# EAGLE design eksos-rj45-breakout-for_slot (EAGLE 7.7.0)
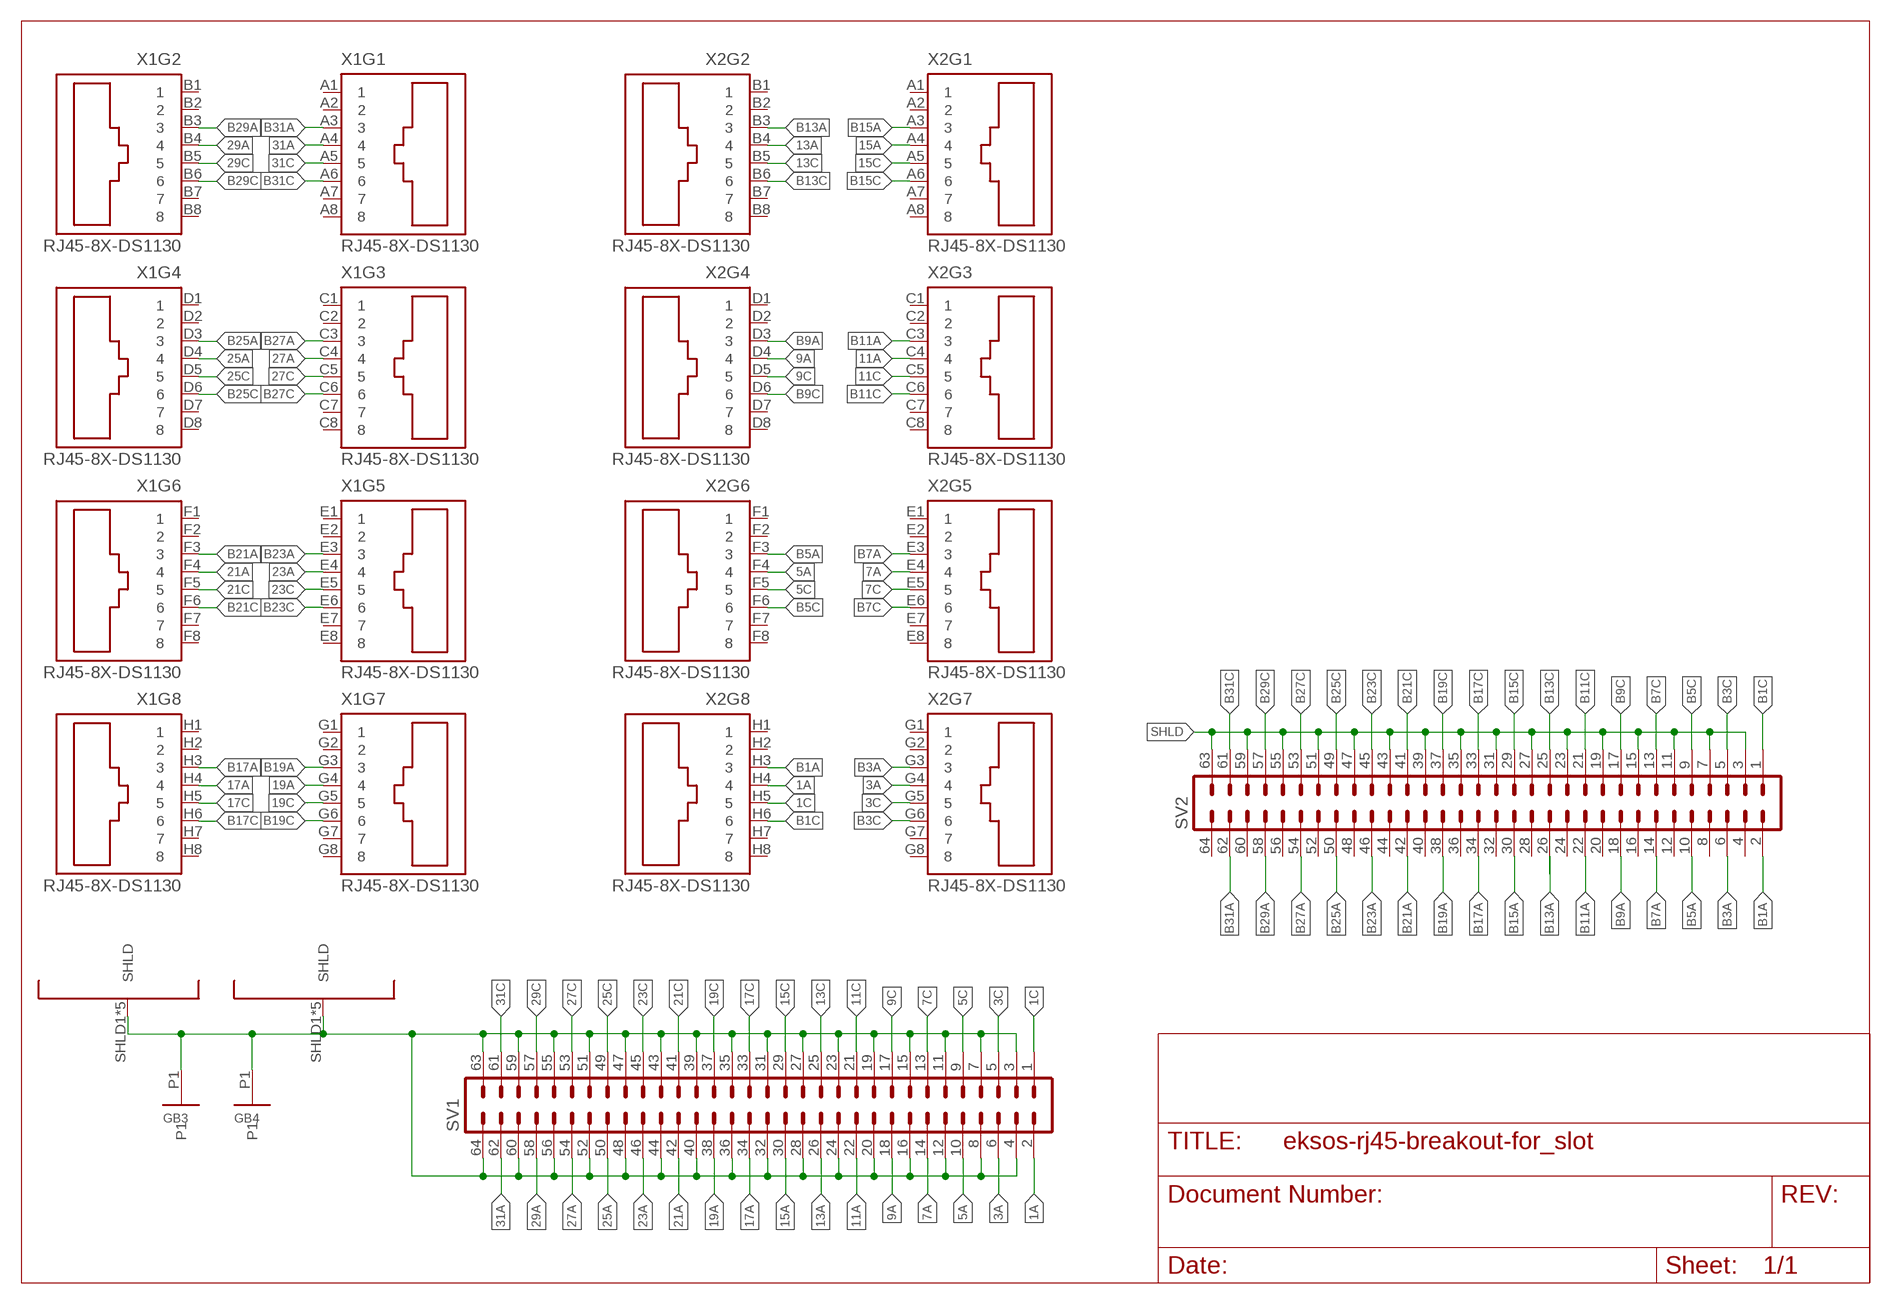
[diagram p0: schematic, sheet 1]

## Parts
GB3  GEWINDEBLOCK-6X6X12M3  [GB6X6X12_VIA]
GB4  GEWINDEBLOCK-6X6X12M3  [GB6X6X12_VIA]
SV1  ML64  [ML64]
SV2  ML64  [ML64]
X1  RJ45-8X-DS1130  [DS1130]
X2  RJ45-8X-DS1130  [DS1130]

## Nets
1A: SV1.2 X2.H4
1C: SV1.1 X2.H5
3A: SV1.6 X2.G4
3C: SV1.5 X2.G5
5A: SV1.10 X2.F4
5C: SV1.9 X2.F5
7A: SV1.14 X2.E4
7C: SV1.13 X2.E5
9A: SV1.18 X2.D4
9C: SV1.17 X2.D5
11A: SV1.22 X2.C4
11C: SV1.21 X2.C5
13A: SV1.26 X2.B4
13C: SV1.25 X2.B5
15A: SV1.30 X2.A4
15C: SV1.29 X2.A5
17A: SV1.34 X1.H4
17C: SV1.33 X1.H5
19A: SV1.38 X1.G4
19C: SV1.37 X1.G5
21A: SV1.42 X1.F4
21C: SV1.41 X1.F5
23A: SV1.46 X1.E4
23C: SV1.45 X1.E5
25A: SV1.50 X1.D4
25C: SV1.49 X1.D5
27A: SV1.54 X1.C4
27C: SV1.53 X1.C5
29A: SV1.58 X1.B4
29C: SV1.57 X1.B5
31A: SV1.62 X1.A4
31C: SV1.61 X1.A5
B1A: SV2.2 X2.H3
B1C: SV2.1 X2.H6
B3A: SV2.6 X2.G3
B3C: SV2.5 X2.G6
B5A: SV2.10 X2.F3
B5C: SV2.9 X2.F6
B7A: SV2.14 X2.E3
B7C: SV2.13 X2.E6
B9A: SV2.18 X2.D3
B9C: SV2.17 X2.D6
B11A: SV2.22 X2.C3
B11C: SV2.21 X2.C6
B13A: SV2.26 X2.B3
B13C: SV2.25 X2.B6
B15A: SV2.30 X2.A3
B15C: SV2.29 X2.A6
B17A: SV2.34 X1.H3
B17C: SV2.33 X1.H6
B19A: SV2.38 X1.G3
B19C: SV2.37 X1.G6
B21A: SV2.42 X1.F3
B21C: SV2.41 X1.F6
B23A: SV2.46 X1.E3
B23C: SV2.45 X1.E6
B25A: SV2.50 X1.D3
B25C: SV2.49 X1.D6
B27A: SV2.54 X1.C3
B27C: SV2.53 X1.C6
B29A: SV2.58 X1.B3
B29C: SV2.57 X1.B6
B31A: SV2.62 X1.A3
B31C: SV2.61 X1.A6
SHLD: GB3.P1 GB4.P1 SV1.3 SV1.4 SV1.7 SV1.8 SV1.11 SV1.12 SV1.15 SV1.16 SV1.19 SV1.20 SV1.23 SV1.24 SV1.27 SV1.28 SV1.31 SV1.32 SV1.35 SV1.36 SV1.39 SV1.40 SV1.43 SV1.44 SV1.47 SV1.48 SV1.51 SV1.52 SV1.55 SV1.56 SV1.59 SV1.60 SV1.63 SV1.64 SV2.3 SV2.7 SV2.11 SV2.15 SV2.19 SV2.23 SV2.27 SV2.31 SV2.35 SV2.39 SV2.43 SV2.47 SV2.51 SV2.55 SV2.59 SV2.63 X1.SHLD1(SHLD) X1.SHLD2(SHLD) X1.SHLD3(SHLD) X1.SHLD4(SHLD) X1.SHLD5(SHLD) X2.SHLD1(SHLD) X2.SHLD2(SHLD) X2.SHLD3(SHLD) X2.SHLD4(SHLD) X2.SHLD5(SHLD)
Unconnected: SV2.4 SV2.8 SV2.12 SV2.16 SV2.20 SV2.24 SV2.28 SV2.32 SV2.36 SV2.40 SV2.44 SV2.48 SV2.52 SV2.56 SV2.60 SV2.64 X1.A1 X1.A2 X1.A7 X1.A8 X1.B1 X1.B2 X1.B7 X1.B8 X1.C1 X1.C2 X1.C7 X1.C8 X1.D1 X1.D2 X1.D7 X1.D8 X1.E1 X1.E2 X1.E7 X1.E8 X1.F1 X1.F2 X1.F7 X1.F8 X1.G1 X1.G2 X1.G7 X1.G8 X1.H1 X1.H2 X1.H7 X1.H8 X2.A1 X2.A2 X2.A7 X2.A8 X2.B1 X2.B2 X2.B7 X2.B8 X2.C1 X2.C2 X2.C7 X2.C8 X2.D1 X2.D2 X2.D7 X2.D8 X2.E1 X2.E2 X2.E7 X2.E8 X2.F1 X2.F2 X2.F7 X2.F8 X2.G1 X2.G2 X2.G7 X2.G8 X2.H1 X2.H2 X2.H7 X2.H8

## Library data of the parts
GB3 GB4 = mechanical:GEWINDEBLOCK
SV1 SV2 = con-harting-ml:ML64: HARTING; OC_FARNELL: unknown; OC_NEWARK: unknown
X1 X2 = stewart-rj45:RJ45-8X: 8-port RJ45 jack

## Net classes
0 default: width 0.305 mm

## Board
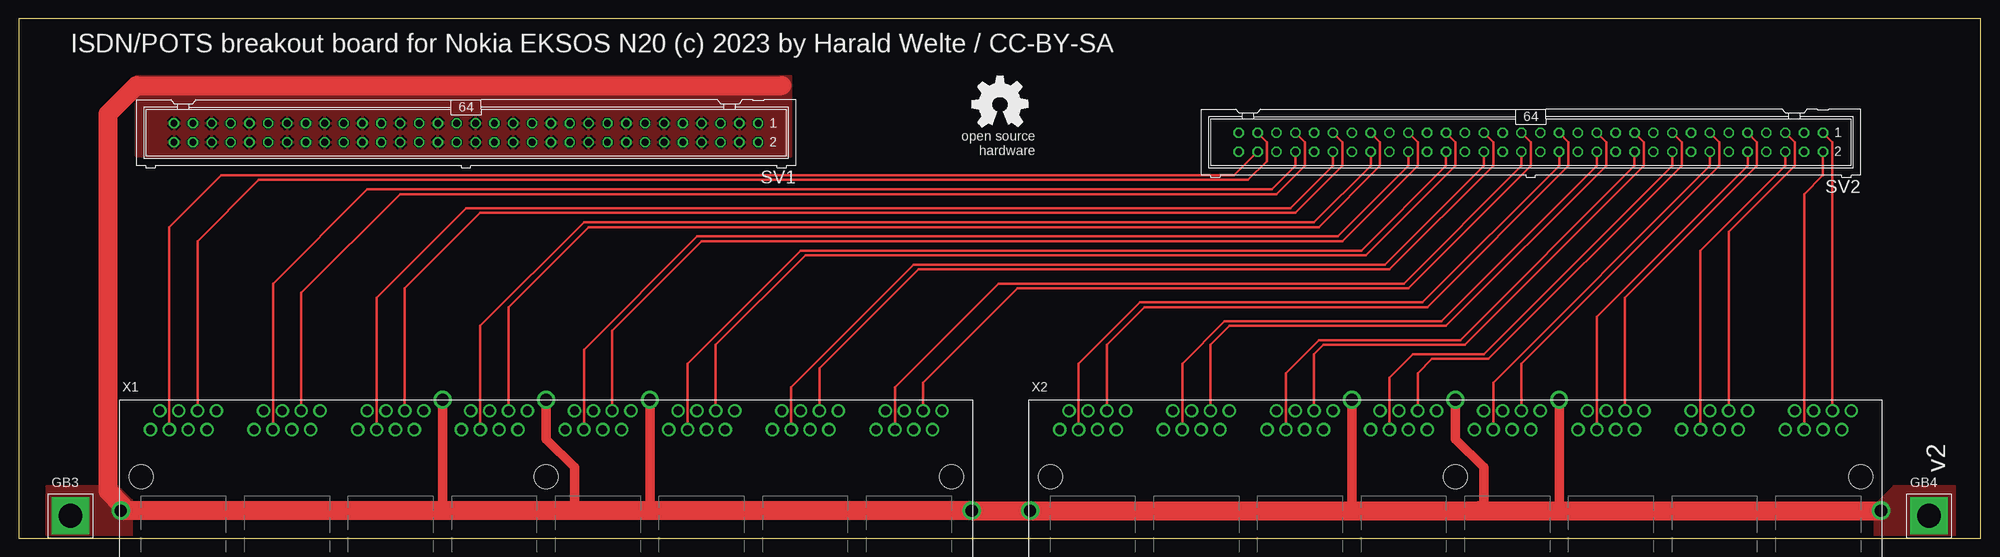
[diagram p1: board, top side]
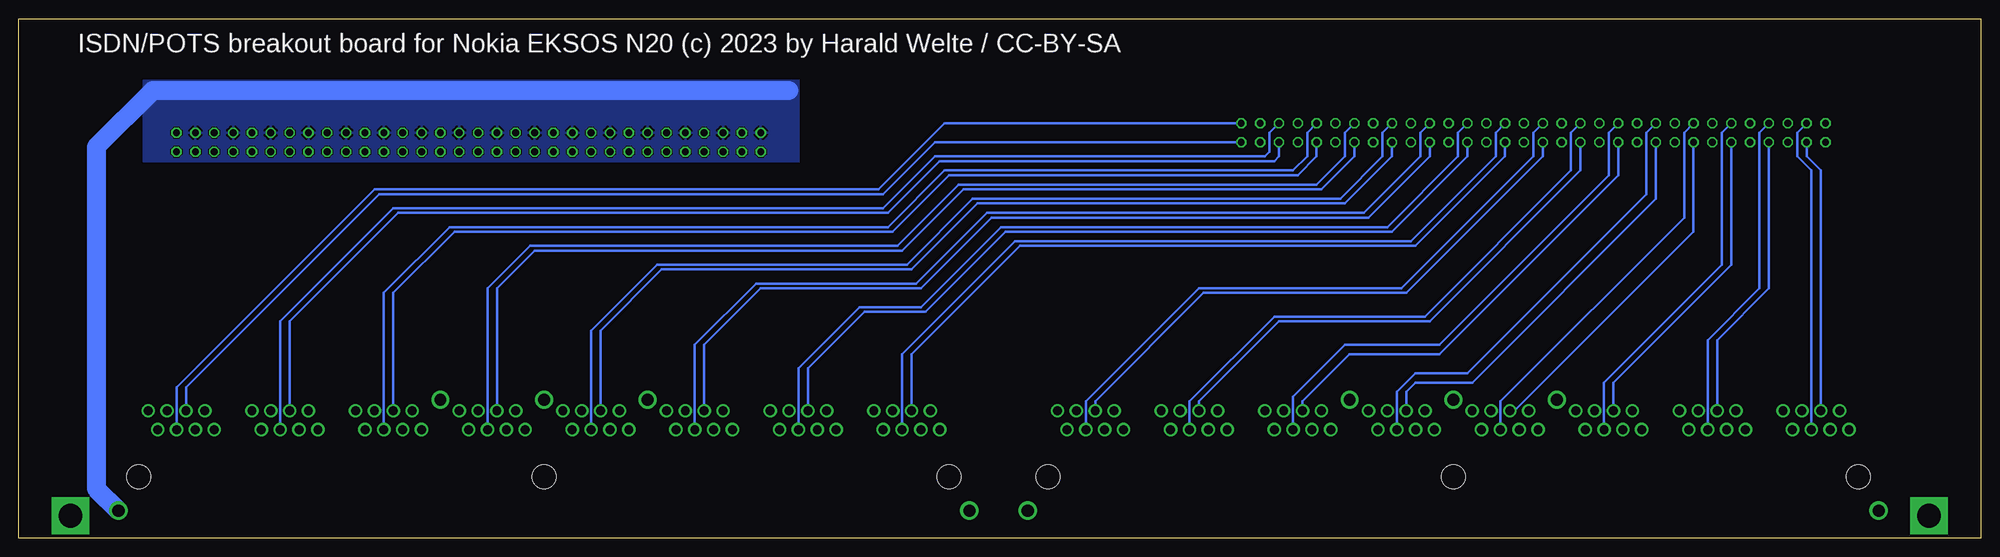
[diagram p2: board, bottom side, seen from below]

Size 264.5 x 70 mm. Coordinates in mm from the lower left corner, seen from the top.
Outline: 0,0 264.5,0 264.5,70 0,70 0,0
Copper layers (1*16): Top 0.035mm / dielectric 1.5mm / Bottom 0.035mm
Design rules "aisler_2_layer_simple": minimum track width 0.2mm, minimum drill 0.45mm, track to track 0.175mm, track to pad 0.175mm, pad to pad 0.175mm, via to via 0.175mm, smd to smd 0.175mm, copper to edge 0.3mm, drill to drill 0.25mm, minimum pad ring 0.2mm, minimum via ring 0.2mm, stop-mask expansion 0mil, vias tented up to drill 0mil, thermal gap 10mil
tKeepout: area 0,0 to 3,70; area 261.5,0 to 264.5,70

### Footprints (pad centres in the part's own frame; a part is rotated, then mirrored left to right if it is on the bottom)
GB6X6X12_VIA = drill 3.2 pad 5 square: P1 0,0
ML64 = drill 0.914 octagon: 1 -39.37,-1.27; 2 -39.37,1.27; 3 -36.83,-1.27; 4 -36.83,1.27; 5 -34.29,-1.27; 6 -34.29,1.27; 7 -31.75,-1.27; 8 -31.75,1.27; 9 -29.21,-1.27; 10 -29.21,1.27; 11 -26.67,-1.27; 12 -26.67,1.27; 13 -24.13,-1.27; 14 -24.13,1.27; 15 -21.59,-1.27; 16 -21.59,1.27; 17 -19.05,-1.27; 18 -19.05,1.27; 19 -16.51,-1.27; 20 -16.51,1.27; 21 -13.97,-1.27; 22 -13.97,1.27; 23 -11.43,-1.27; 24 -11.43,1.27; 25 -8.89,-1.27; 26 -8.89,1.27; 27 -6.35,-1.27; 28 -6.35,1.27; 29 -3.81,-1.27; 30 -3.81,1.27; 31 -1.27,-1.27; 32 -1.27,1.27; 33 1.27,-1.27; 34 1.27,1.27; 35 3.81,-1.27; 36 3.81,1.27; 37 6.35,-1.27; 38 6.35,1.27; 39 8.89,-1.27; 40 8.89,1.27; 41 11.43,-1.27; 42 11.43,1.27; 43 13.97,-1.27; 44 13.97,1.27; 45 16.51,-1.27; 46 16.51,1.27; 47 19.05,-1.27; 48 19.05,1.27; 49 21.59,-1.27; 50 21.59,1.27; 51 24.13,-1.27; 52 24.13,1.27; 53 26.67,-1.27; 54 26.67,1.27; 55 29.21,-1.27; 56 29.21,1.27; 57 31.75,-1.27; 58 31.75,1.27; 59 34.29,-1.27; 60 34.29,1.27; 61 36.83,-1.27; 62 36.83,1.27; 63 39.37,-1.27; 64 39.37,1.27
DS1130 = drill 1.2: A1 -53.34,6.35; A2 -52.07,8.89; A3 -50.8,6.35; A4 -49.53,8.89; A5 -48.26,6.35; A6 -46.99,8.89; A7 -45.72,6.35; A8 -44.45,8.89; B1 -39.37,6.35; B2 -38.1,8.89; B3 -36.83,6.35; B4 -35.56,8.89; B5 -34.29,6.35; B6 -33.02,8.89; B7 -31.75,6.35; B8 -30.48,8.89; C1 -25.4,6.35; C2 -24.13,8.89; C3 -22.86,6.35; C4 -21.59,8.89; C5 -20.32,6.35; C6 -19.05,8.89; C7 -17.78,6.35; C8 -16.51,8.89; D1 -11.43,6.35; D2 -10.16,8.89; D3 -8.89,6.35; D4 -7.62,8.89; D5 -6.35,6.35; D6 -5.08,8.89; D7 -3.81,6.35; D8 -2.54,8.89; E1 2.54,6.35; E2 3.81,8.89; E3 5.08,6.35; E4 6.35,8.89; E5 7.62,6.35; E6 8.89,8.89; E7 10.16,6.35; E8 11.43,8.89; F1 16.51,6.35; F2 17.78,8.89; F3 19.05,6.35; F4 20.32,8.89; F5 21.59,6.35; F6 22.86,8.89; F7 24.13,6.35; F8 25.4,8.89; G1 30.48,6.35; G2 31.75,8.89; G3 33.02,6.35; G4 34.29,8.89; G5 35.56,6.35; G6 36.83,8.89; G7 38.1,6.35; G8 39.37,8.89; H1 44.45,6.35; H2 45.72,8.89; H3 46.99,6.35; H4 48.26,8.89; H5 49.53,6.35; H6 50.8,8.89; H7 52.07,6.35; H8 53.34,8.89 | drill 1.66: SHLD1 -57.345,-4.57; SHLD2 57.345,-4.57 | drill 1.6: SHLD3 0,10.38; SHLD4 13.97,10.38; SHLD5 -13.97,10.38 | hole 3.25: -54.61,0; 54.61,0; 0,0

### Placement (x,y rotation side)
GB3  7,3 0 top
GB4  257.5,3 0 top
SV1  60.33,54.61 180 top
SV2  203.84,53.34 180 top
U$1  [OSHW_8MM]  132.25,58.42 0 top
X1  71.12,8.26 0 top
X2  193.68,8.26 0 top

### Tracks (layer width: path | path; a pad name or v marks a point on that pad's centre or on a via)
1A
  Bottom 0.305: SV1.2 140.97,53.34 147.96,46.35 215.9,46.35 241.94,20.32 X2.H4
1C
  Bottom 0.305: SV1.1 139.7,55.88 148.59,46.99 216.53,46.99 243.21,20.32 X2.H5
3A
  Bottom 0.305: X2.G4 227.97,29.21 213.36,43.81 147.32,43.81 140.34,50.8 95.25,50.8 94.61,51.44 SV1.6
3C
  Bottom 0.305: X2.G5 229.24,29.21 214,44.45 147.96,44.45 140.97,51.44 96.52,51.44 95.89,52.07 95.89,54.61 SV1.5
5A
  Bottom 0.305: X2.F4 214,33.02 205.74,41.27 146.69,41.27 139.06,48.9 92.08,48.9 89.53,51.44 SV1.10
5C
  Bottom 0.305: X2.F5 215.26,33.02 206.38,41.91 147.32,41.91 139.7,49.53 92.71,49.53 90.81,51.44 90.81,54.61 SV1.9
7A
  Bottom 0.305: X2.E4 200.03,33.66 194.94,38.73 145.41,38.73 137.16,46.99 88.9,46.99 84.45,51.44 SV1.14
7C
  Bottom 0.305: X2.E5 201.29,33.66 195.58,39.37 146.05,39.37 137.79,47.62 89.53,47.62 85.72,51.44 85.72,54.61 SV1.13
9A
  Bottom 0.305: X2.D4 186.06,27.94 177.8,36.2 144.15,36.2 135.25,45.09 85.72,45.09 79.38,51.44 SV1.18
9C
  Bottom 0.305: X2.D5 187.32,27.94 178.44,36.83 144.78,36.83 135.89,45.72 86.36,45.72 80.64,51.44 80.64,54.61 SV1.17
11A
  Bottom 0.305: X2.C4 172.09,26.04 164.47,33.66 142.88,33.66 133.35,43.18 82.55,43.18 74.3,51.44 SV1.22
11C
  Bottom 0.305: X2.C5 173.35,26.04 165.1,34.29 143.51,34.29 133.99,43.81 83.19,43.81 75.56,51.44 75.56,54.61 SV1.21
13A
  Bottom 0.305: X2.B4 158.12,22.86 150.5,30.48 142.24,30.48 131.44,41.27 79.38,41.27 69.22,51.44 SV1.26
13C
  Bottom 0.305: X2.B5 159.38,22.86 151.13,31.11 142.88,31.11 132.08,41.91 80.01,41.91 70.48,51.44 70.48,54.61 SV1.25
15A
  Bottom 0.305: X2.A4 144.15,24.77 129.54,39.37 76.2,39.37 64.14,51.44 SV1.30
15C
  Bottom 0.305: X2.A5 145.41,24.77 130.18,40.01 76.83,40.01 65.41,51.44 65.41,54.61 SV1.29
17A
  Bottom 0.305: X1.H4 119.38,18.41 104.78,33.02 77.47,33.02 59.05,51.44 SV1.34
17C
  Bottom 0.305: X1.H5 120.65,18.41 105.41,33.66 78.11,33.66 60.33,51.44 60.33,54.61 SV1.33
19A
  Bottom 0.305: X1.G4 105.41,18.41 94.61,29.21 74.3,29.21 53.98,49.53 SV1.38
19C
  Bottom 0.305: X1.G5 106.68,18.41 95.25,29.84 74.93,29.84 55.24,49.53 55.24,54.61 SV1.37
21A
  Bottom 0.305: X1.F4 91.44,18.41 85.09,24.77 73.03,24.77 48.9,48.9 SV1.42
21C
  Bottom 0.305: X1.F5 92.71,19.05 85.72,26.04 73.03,26.04 50.16,48.9 50.16,54.61 SV1.41
23A
  Bottom 0.305: X1.E4 77.47,19.68 76.2,20.95 68.58,20.95 43.81,45.72 SV1.46
23C
  Bottom 0.305: X1.E5 78.74,19.68 76.2,22.23 69.22,22.23 45.09,46.35 45.09,54.61 SV1.45
25A
  Bottom 0.305: X1.D4 62.87,17.14 38.73,41.27 SV1.50
25C
  Bottom 0.305: X1.D5 64.77,18.41 40.01,43.18 40.01,54.61 SV1.49
27A
  Bottom 0.305: X1.C4 49.53,20.95 33.66,36.83 SV1.54
27C
  Bottom 0.305: X1.C5 50.8,20.95 34.92,36.83 34.92,54.61 SV1.53
29A
  Bottom 0.305: X1.B4 35.56,26.67 28.57,33.66 SV1.58
29C
  Bottom 0.305: X1.B5 36.83,26.67 29.84,33.66 29.84,54.61 SV1.57
31A
  Bottom 0.305: X1.A4 21.59,49.53 23.5,51.44 SV1.62
31C
  Bottom 0.305: X1.A5 22.86,49.53 24.77,51.44 24.77,54.61 SV1.61
B1A
  Top 0.305: X2.H3 240.66,46.35 243.21,48.9 SV2.2
B1C
  Top 0.305: X2.H6 244.47,53.34 SV2.1
B3A
  Top 0.305: X2.G3 226.69,38.73 238.12,50.16 SV2.6
B3C
  Top 0.305: X2.G6 230.5,41.27 239.4,50.16 239.4,53.34 SV2.5
B5A
  Top 0.305: X2.F3 212.72,29.84 233.04,50.16 SV2.10
B5C
  Top 0.305: X2.F6 216.53,32.38 234.31,50.16 234.31,53.34 SV2.9
B7A
  Top 0.305: X2.E3 198.75,20.95 227.97,50.16 SV2.14
B7C
  Top 0.305: X2.E6 202.56,23.5 229.24,50.16 229.24,53.34 SV2.13
B9A
  Top 0.305: X2.D3 184.78,21.59 187.96,24.77 197.49,24.77 222.88,50.16 SV2.18
B9C
  Top 0.305: X2.D6 188.59,22.23 190.5,24.13 198.12,24.13 224.16,50.16 224.16,53.34 SV2.17
B11A
  Top 0.305: X2.C3 170.81,22.23 175.26,26.67 194.31,26.67 217.81,50.16 SV2.22
B11C
  Top 0.305: X2.C6 174.62,24.77 175.9,26.04 194.94,26.04 219.07,50.16 219.07,53.34 SV2.21
B13A
  Top 0.305: X2.B3 156.84,23.5 162.56,29.21 191.77,29.21 212.72,50.16 SV2.26
B13C
  Top 0.305: X2.B6 160.66,26.04 163.19,28.57 192.41,28.57 214,50.16 214,53.34 SV2.25
B15A
  Top 0.305: X2.A3 142.88,23.5 151.13,31.75 189.23,31.75 207.65,50.16 SV2.30
B15C
  Top 0.305: X2.A6 146.69,26.04 151.76,31.11 189.87,31.11 208.91,50.16 208.91,53.34 SV2.29
B17A
  Top 0.305: X1.H3 118.11,20.32 132.08,34.29 186.69,34.29 202.56,50.16 SV2.34
B17C
  Top 0.305: X1.H6 121.92,20.95 134.62,33.66 187.32,33.66 203.84,50.16 203.84,53.34 SV2.33
B19A
  Top 0.305: X1.G3 104.14,20.32 120.65,36.83 184.15,36.83 197.49,50.16 SV2.38
B19C
  Top 0.305: X1.G6 107.95,22.86 121.28,36.2 184.78,36.2 198.75,50.16 198.75,53.34 SV2.37
B21A
  Top 0.305: X1.F3 90.17,23.5 105.41,38.73 180.97,38.73 192.41,50.16 SV2.42
B21C
  Top 0.305: X1.F6 93.98,26.04 106.05,38.1 181.61,38.1 193.68,50.16 193.68,53.34 SV2.41
B23A
  Top 0.305: X1.E3 76.2,25.4 91.44,40.64 177.8,40.64 187.32,50.16 SV2.46
B23C
  Top 0.305: X1.E6 80.64,17.14 80.01,17.78 80.01,27.94 92.08,40.01 178.44,40.01 188.59,50.16 188.59,53.34 SV2.45
B25A
  Top 0.305: X1.D3 62.23,28.57 76.2,42.55 174.62,42.55 182.25,50.16 SV2.50
B25C
  Top 0.305: X1.D6 66.04,31.11 76.83,41.91 175.26,41.91 183.51,50.16 183.51,53.34 SV2.49
B27A
  Top 0.305: X1.C3 48.26,32.38 60.33,44.45 171.45,44.45 177.16,50.16 SV2.54
B27C
  Top 0.305: X1.C6 52.07,33.66 62.23,43.81 172.09,43.81 178.44,50.16 178.44,53.34 SV2.53
B29A
  Top 0.305: X1.B3 34.29,34.29 46.99,46.99 168.91,46.99 172.09,50.16 SV2.58
B29C
  Top 0.305: X1.B6 38.1,33.02 51.44,46.35 169.54,46.35 173.35,50.16 173.35,53.34 SV2.57
B31A
  Top 0.305: X1.A3 20.32,41.91 27.3,48.9 163.83,48.9 SV2.62
B31C
  Top 0.305: X1.A6 24.13,40.01 32.38,48.26 165.74,48.26 168.28,50.8 168.28,53.34 SV2.61
SHLD
  Top 1.27: X1.SHLD5 57.15,3.69 | X1.SHLD4 85.09,3.69 | X1.SHLD3 71.12,13.34 74.93,9.53 74.93,3.69 | X2.SHLD5 179.71,3.69 | X2.SHLD4 207.65,3.69 | X2.SHLD3 193.68,13.34 197.49,9.53 197.49,3.81 196.85,3.17 196.85,3.69
  Top 2.54: 13.97,3.88 X1.SHLD1 57.15,3.69 74.93,3.69 85.09,3.69 X1.SHLD2 X2.SHLD1 179.71,3.69 196.85,3.69 207.65,3.69 X2.SHLD2 | 102.87,60.96 15.88,60.96 12.06,57.15 12.06,6.35 13.97,4.45 13.97,3.81
  Bottom 2.54: 160.66,60.33 246.38,60.33 254,52.7 254,6.67 X2.SHLD2
  pour Top: 15.88,62.23 15.88,51.44 104.14,51.44 104.14,62.23
  pour Bottom: 159.38,61.59 159.38,50.8 247.65,50.8 247.65,61.59
  pour Top (no thermals): 12.06,6.99 3.81,6.99 3.81,0 14.61,0 15.24,0 15.24,5.08 13.34,6.99
  pour Top (no thermals): 250.19,4.45 252.73,6.99 260.99,6.99 260.99,0 250.19,0

### Text on the board
tPlace: ISDN/POTS breakout board for Nokia EKSOS N20 (c) 2023 by Harald Welte / CC-BY-SA
bPlace: ISDN/POTS breakout board for Nokia EKSOS N20 (c) 2023 by Harald Welte / CC-BY-SA